# Altium project Time_skew.PrjPcb
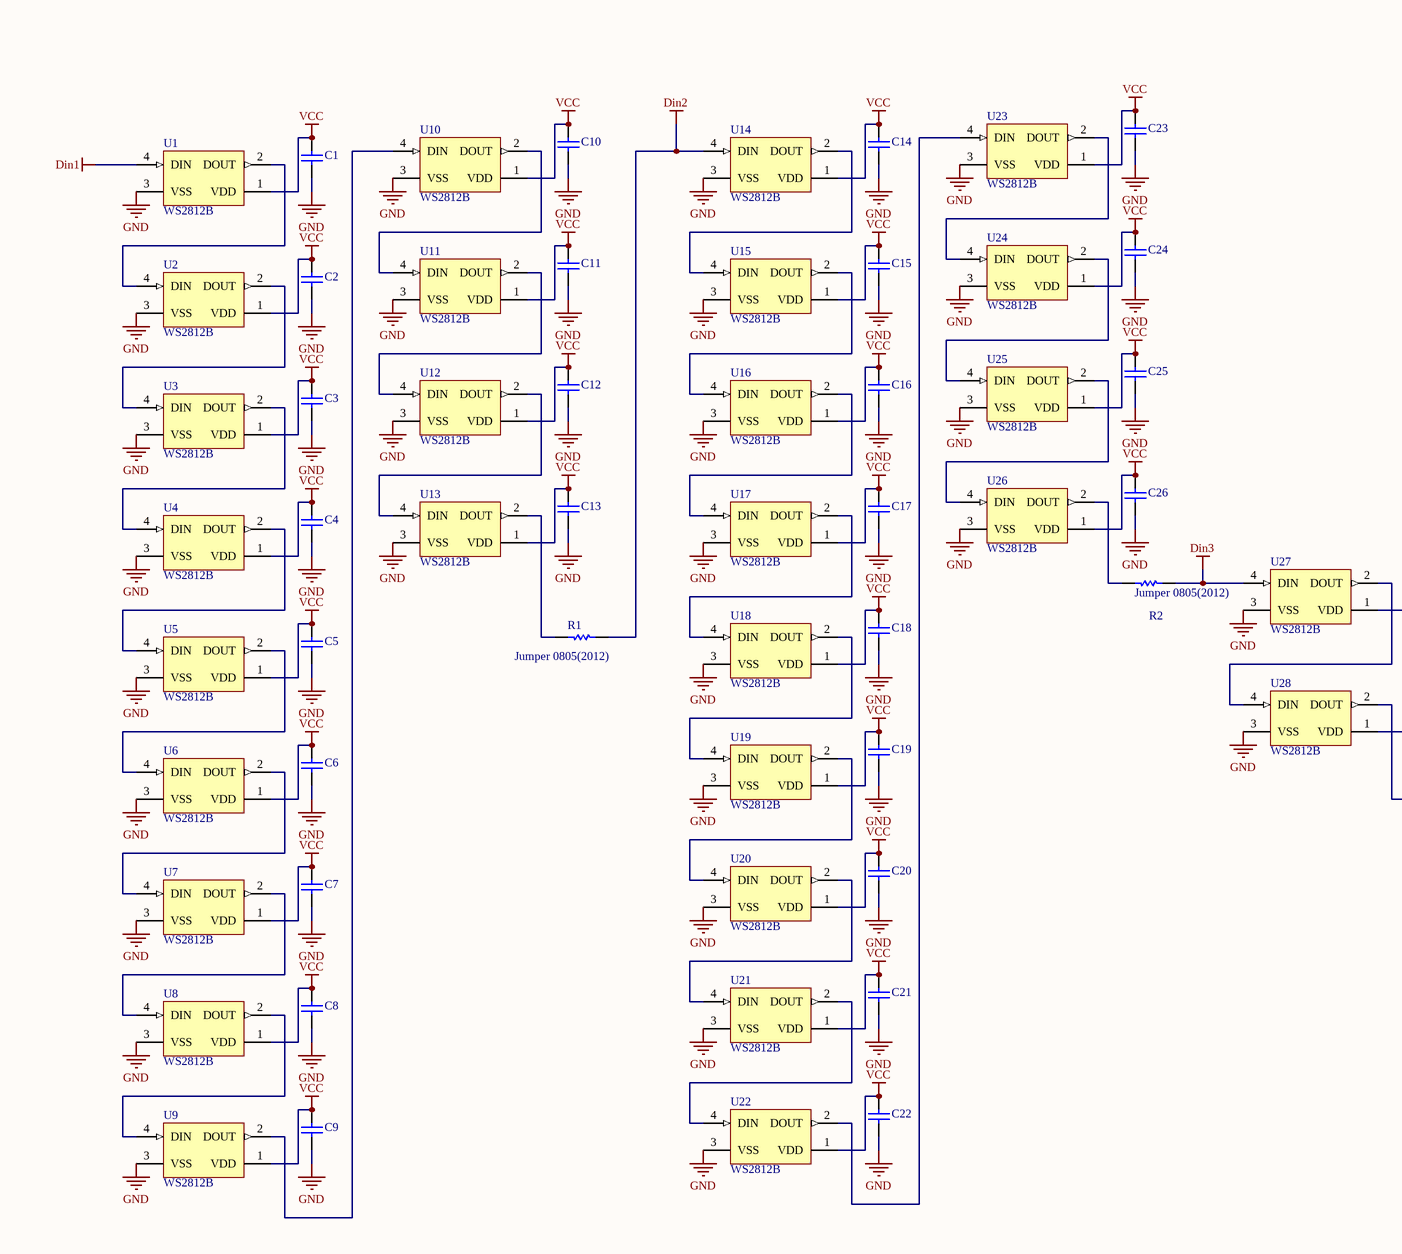
[diagram p0: Time._skew.SchDoc, left]
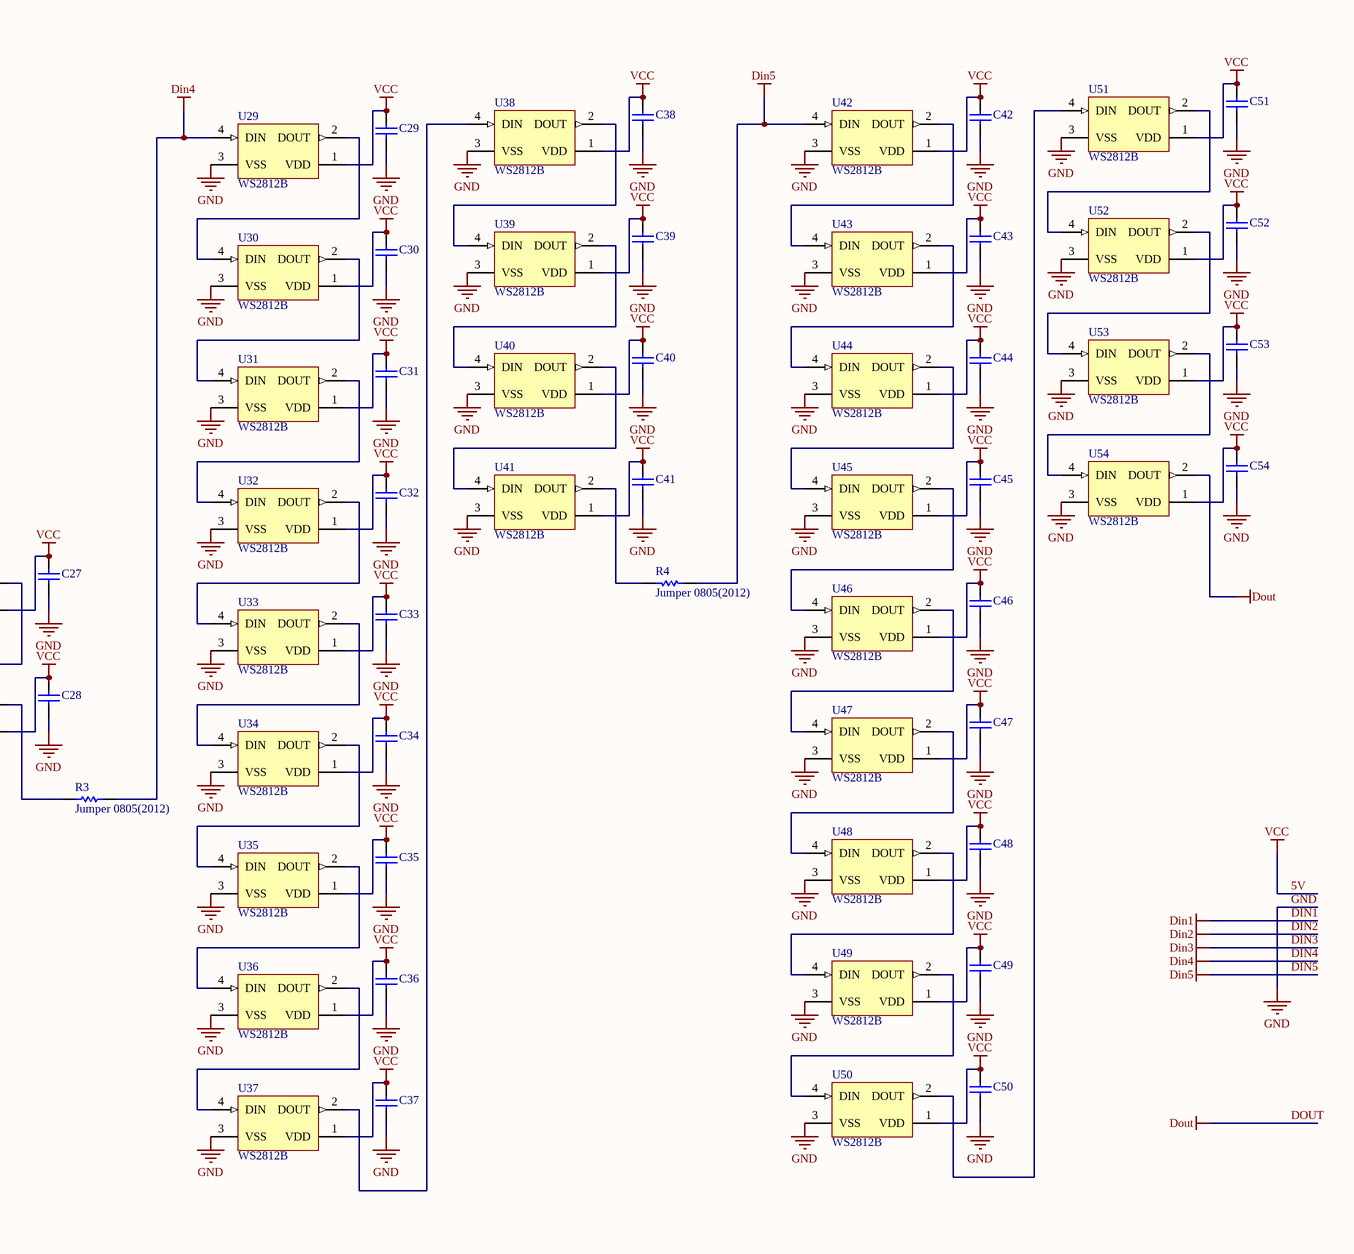
[diagram p1: Time._skew.SchDoc, right]
1 sheet, 112 parts. Net scope: global (net labels, ports and power ports of the same name join across sheets).
Board file: Time_skew.PcbDoc

## Sheet Time._skew.SchDoc: Time_skew
size A2; CheckedBy: Othniel Konan; Author: Othniel Konan; DrawnBy: Othniel Konan; Engineer: Othniel Konan; Address1: NPSC; Address2: Othniel Konan; Address3: ECE 2017; DocumentNumber: 1; Revision: 1.0; SheetNumber: 1; SheetTotal: 1; ProjectName: NPC

### Parts
C1  CAP 0.5pF 10V 0805(2012)  [CAPC0805(2012)100_L]  (value not drawn)
C2  CAP 0.5pF 10V 0805(2012)  [CAPC0805(2012)100_L]  (value not drawn)
C3  CAP 0.5pF 10V 0805(2012)  [CAPC0805(2012)100_L]  (value not drawn)
C4  CAP 0.5pF 10V 0805(2012)  [CAPC0805(2012)100_L]  (value not drawn)
C5  CAP 0.5pF 10V 0805(2012)  [CAPC0805(2012)100_L]  (value not drawn)
C6  CAP 0.5pF 10V 0805(2012)  [CAPC0805(2012)100_L]  (value not drawn)
C7  CAP 0.5pF 10V 0805(2012)  [CAPC0805(2012)100_L]  (value not drawn)
C8  CAP 0.5pF 10V 0805(2012)  [CAPC0805(2012)100_L]  (value not drawn)
C9  CAP 0.5pF 10V 0805(2012)  [CAPC0805(2012)100_L]  (value not drawn)
C10  CAP 0.5pF 10V 0805(2012)  [CAPC0805(2012)100_L]  (value not drawn)
C11  CAP 0.5pF 10V 0805(2012)  [CAPC0805(2012)100_L]  (value not drawn)
C12  CAP 0.5pF 10V 0805(2012)  [CAPC0805(2012)100_L]  (value not drawn)
C13  CAP 0.5pF 10V 0805(2012)  [CAPC0805(2012)100_L]  (value not drawn)
C14  CAP 0.5pF 10V 0805(2012)  [CAPC0805(2012)100_L]  (value not drawn)
C15  CAP 0.5pF 10V 0805(2012)  [CAPC0805(2012)100_L]  (value not drawn)
C16  CAP 0.5pF 10V 0805(2012)  [CAPC0805(2012)100_L]  (value not drawn)
C17  CAP 0.5pF 10V 0805(2012)  [CAPC0805(2012)100_L]  (value not drawn)
C18  CAP 0.5pF 10V 0805(2012)  [CAPC0805(2012)100_L]  (value not drawn)
C19  CAP 0.5pF 10V 0805(2012)  [CAPC0805(2012)100_L]  (value not drawn)
C20  CAP 0.5pF 10V 0805(2012)  [CAPC0805(2012)100_L]  (value not drawn)
C21  CAP 0.5pF 10V 0805(2012)  [CAPC0805(2012)100_L]  (value not drawn)
C22  CAP 0.5pF 10V 0805(2012)  [CAPC0805(2012)100_L]  (value not drawn)
C23  CAP 0.5pF 10V 0805(2012)  [CAPC0805(2012)100_L]  (value not drawn)
C24  CAP 0.5pF 10V 0805(2012)  [CAPC0805(2012)100_L]  (value not drawn)
C25  CAP 0.5pF 10V 0805(2012)  [CAPC0805(2012)100_L]  (value not drawn)
C26  CAP 0.5pF 10V 0805(2012)  [CAPC0805(2012)100_L]  (value not drawn)
C27  CAP 0.5pF 10V 0805(2012)  [CAPC0805(2012)100_L]  (value not drawn)
C28  CAP 0.5pF 10V 0805(2012)  [CAPC0805(2012)100_L]  (value not drawn)
C29  CAP 0.5pF 10V 0805(2012)  [CAPC0805(2012)100_L]  (value not drawn)
C30  CAP 0.5pF 10V 0805(2012)  [CAPC0805(2012)100_L]  (value not drawn)
C31  CAP 0.5pF 10V 0805(2012)  [CAPC0805(2012)100_L]  (value not drawn)
C32  CAP 0.5pF 10V 0805(2012)  [CAPC0805(2012)100_L]  (value not drawn)
C33  CAP 0.5pF 10V 0805(2012)  [CAPC0805(2012)100_L]  (value not drawn)
C34  CAP 0.5pF 10V 0805(2012)  [CAPC0805(2012)100_L]  (value not drawn)
C35  CAP 0.5pF 10V 0805(2012)  [CAPC0805(2012)100_L]  (value not drawn)
C36  CAP 0.5pF 10V 0805(2012)  [CAPC0805(2012)100_L]  (value not drawn)
C37  CAP 0.5pF 10V 0805(2012)  [CAPC0805(2012)100_L]  (value not drawn)
C38  CAP 0.5pF 10V 0805(2012)  [CAPC0805(2012)100_L]  (value not drawn)
C39  CAP 0.5pF 10V 0805(2012)  [CAPC0805(2012)100_L]  (value not drawn)
C40  CAP 0.5pF 10V 0805(2012)  [CAPC0805(2012)100_L]  (value not drawn)
C41  CAP 0.5pF 10V 0805(2012)  [CAPC0805(2012)100_L]  (value not drawn)
C42  CAP 0.5pF 10V 0805(2012)  [CAPC0805(2012)100_L]  (value not drawn)
C43  CAP 0.5pF 10V 0805(2012)  [CAPC0805(2012)100_L]  (value not drawn)
C44  CAP 0.5pF 10V 0805(2012)  [CAPC0805(2012)100_L]  (value not drawn)
C45  CAP 0.5pF 10V 0805(2012)  [CAPC0805(2012)100_L]  (value not drawn)
C46  CAP 0.5pF 10V 0805(2012)  [CAPC0805(2012)100_L]  (value not drawn)
C47  CAP 0.5pF 10V 0805(2012)  [CAPC0805(2012)100_L]  (value not drawn)
C48  CAP 0.5pF 10V 0805(2012)  [CAPC0805(2012)100_L]  (value not drawn)
C49  CAP 0.5pF 10V 0805(2012)  [CAPC0805(2012)100_L]  (value not drawn)
C50  CAP 0.5pF 10V 0805(2012)  [CAPC0805(2012)100_L]  (value not drawn)
C51  CAP 0.5pF 10V 0805(2012)  [CAPC0805(2012)100_L]  (value not drawn)
C52  CAP 0.5pF 10V 0805(2012)  [CAPC0805(2012)100_L]  (value not drawn)
C53  CAP 0.5pF 10V 0805(2012)  [CAPC0805(2012)100_L]  (value not drawn)
C54  CAP 0.5pF 10V 0805(2012)  [CAPC0805(2012)100_L]  (value not drawn)
R1  Jumper 0805(2012)  [RESC0805(2012)_N]
R2  Jumper 0805(2012)  [RESC0805(2012)_N]
R3  Jumper 0805(2012)  [RESC0805(2012)_N]
R4  Jumper 0805(2012)  [RESC0805(2012)_N]
U1  WS2812B  [ADAI-WS2812B_V]
U2  WS2812B  [ADAI-WS2812B_V]
U3  WS2812B  [ADAI-WS2812B_V]
U4  WS2812B  [ADAI-WS2812B_V]
U5  WS2812B  [ADAI-WS2812B_V]
U6  WS2812B  [ADAI-WS2812B_V]
U7  WS2812B  [ADAI-WS2812B_V]
U8  WS2812B  [ADAI-WS2812B_V]
U9  WS2812B  [ADAI-WS2812B_V]
U10  WS2812B  [ADAI-WS2812B_V]
U11  WS2812B  [ADAI-WS2812B_V]
U12  WS2812B  [ADAI-WS2812B_V]
U13  WS2812B  [ADAI-WS2812B_V]
U14  WS2812B  [ADAI-WS2812B_V]
U15  WS2812B  [ADAI-WS2812B_V]
U16  WS2812B  [ADAI-WS2812B_V]
U17  WS2812B  [ADAI-WS2812B_V]
U18  WS2812B  [ADAI-WS2812B_V]
U19  WS2812B  [ADAI-WS2812B_V]
U20  WS2812B  [ADAI-WS2812B_V]
U21  WS2812B  [ADAI-WS2812B_V]
U22  WS2812B  [ADAI-WS2812B_V]
U23  WS2812B  [ADAI-WS2812B_V]
U24  WS2812B  [ADAI-WS2812B_V]
U25  WS2812B  [ADAI-WS2812B_V]
U26  WS2812B  [ADAI-WS2812B_V]
U27  WS2812B  [ADAI-WS2812B_V]
U28  WS2812B  [ADAI-WS2812B_V]
U29  WS2812B  [ADAI-WS2812B_V]
U30  WS2812B  [ADAI-WS2812B_V]
U31  WS2812B  [ADAI-WS2812B_V]
U32  WS2812B  [ADAI-WS2812B_V]
U33  WS2812B  [ADAI-WS2812B_V]
U34  WS2812B  [ADAI-WS2812B_V]
U35  WS2812B  [ADAI-WS2812B_V]
U36  WS2812B  [ADAI-WS2812B_V]
U37  WS2812B  [ADAI-WS2812B_V]
U38  WS2812B  [ADAI-WS2812B_V]
U39  WS2812B  [ADAI-WS2812B_V]
U40  WS2812B  [ADAI-WS2812B_V]
U41  WS2812B  [ADAI-WS2812B_V]
U42  WS2812B  [ADAI-WS2812B_V]
U43  WS2812B  [ADAI-WS2812B_V]
U44  WS2812B  [ADAI-WS2812B_V]
U45  WS2812B  [ADAI-WS2812B_V]
U46  WS2812B  [ADAI-WS2812B_V]
U47  WS2812B  [ADAI-WS2812B_V]
U48  WS2812B  [ADAI-WS2812B_V]
U49  WS2812B  [ADAI-WS2812B_V]
U50  WS2812B  [ADAI-WS2812B_V]
U51  WS2812B  [ADAI-WS2812B_V]
U52  WS2812B  [ADAI-WS2812B_V]
U53  WS2812B  [ADAI-WS2812B_V]
U54  WS2812B  [ADAI-WS2812B_V]

### Nets
5V: C1.2 C2.2 C3.2 C4.2 C5.2 C6.2 C7.2 C8.2 C9.2 C10.2 C11.2 C12.2 C13.2 C14.2 C15.2 C16.2 C17.2 C18.2 C19.2 C20.2 C21.2 C22.2 C23.2 C24.2 C25.2 C26.2 C27.2 C28.2 C29.2 C30.2 C31.2 C32.2 C33.2 C34.2 C35.2 C36.2 C37.2 C38.2 C39.2 C40.2 C41.2 C42.2 C43.2 C44.2 C45.2 C46.2 C47.2 C48.2 C49.2 C50.2 C51.2 C52.2 C53.2 C54.2 U1.1(VDD) U2.1(VDD) U3.1(VDD) U4.1(VDD) U5.1(VDD) U6.1(VDD) U7.1(VDD) U8.1(VDD) U9.1(VDD) U10.1(VDD) U11.1(VDD) U12.1(VDD) U13.1(VDD) U14.1(VDD) U15.1(VDD) U16.1(VDD) U17.1(VDD) U18.1(VDD) U19.1(VDD) U20.1(VDD) U21.1(VDD) U22.1(VDD) U23.1(VDD) U24.1(VDD) U25.1(VDD) U26.1(VDD) U27.1(VDD) U28.1(VDD) U29.1(VDD) U30.1(VDD) U31.1(VDD) U32.1(VDD) U33.1(VDD) U34.1(VDD) U35.1(VDD) U36.1(VDD) U37.1(VDD) U38.1(VDD) U39.1(VDD) U40.1(VDD) U41.1(VDD) U42.1(VDD) U43.1(VDD) U44.1(VDD) U45.1(VDD) U46.1(VDD) U47.1(VDD) U48.1(VDD) U49.1(VDD) U50.1(VDD) U51.1(VDD) U52.1(VDD) U53.1(VDD) U54.1(VDD)  [also labelled VCC]
DIN1: U1.4(DIN)
DIN2: R1.2 U14.4(DIN)
DIN3: R2.2 U27.4(DIN)
DIN4: R3.1 U29.4(DIN)
DIN5: R4.1 U42.4(DIN)
DOUT: U54.2(DOUT)
GND: C1.1 C2.1 C3.1 C4.1 C5.1 C6.1 C7.1 C8.1 C9.1 C10.1 C11.1 C12.1 C13.1 C14.1 C15.1 C16.1 C17.1 C18.1 C19.1 C20.1 C21.1 C22.1 C23.1 C24.1 C25.1 C26.1 C27.1 C28.1 C29.1 C30.1 C31.1 C32.1 C33.1 C34.1 C35.1 C36.1 C37.1 C38.1 C39.1 C40.1 C41.1 C42.1 C43.1 C44.1 C45.1 C46.1 C47.1 C48.1 C49.1 C50.1 C51.1 C52.1 C53.1 C54.1 U1.3(VSS) U2.3(VSS) U3.3(VSS) U4.3(VSS) U5.3(VSS) U6.3(VSS) U7.3(VSS) U8.3(VSS) U9.3(VSS) U10.3(VSS) U11.3(VSS) U12.3(VSS) U13.3(VSS) U14.3(VSS) U15.3(VSS) U16.3(VSS) U17.3(VSS) U18.3(VSS) U19.3(VSS) U20.3(VSS) U21.3(VSS) U22.3(VSS) U23.3(VSS) U24.3(VSS) U25.3(VSS) U26.3(VSS) U27.3(VSS) U28.3(VSS) U29.3(VSS) U30.3(VSS) U31.3(VSS) U32.3(VSS) U33.3(VSS) U34.3(VSS) U35.3(VSS) U36.3(VSS) U37.3(VSS) U38.3(VSS) U39.3(VSS) U40.3(VSS) U41.3(VSS) U42.3(VSS) U43.3(VSS) U44.3(VSS) U45.3(VSS) U46.3(VSS) U47.3(VSS) U48.3(VSS) U49.3(VSS) U50.3(VSS) U51.3(VSS) U52.3(VSS) U53.3(VSS) U54.3(VSS)
NetR1_1: R1.1 U13.2(DOUT)
NetR2_1: R2.1 U26.2(DOUT)
NetR3_2: R3.2 U28.2(DOUT)
NetR4_2: R4.2 U41.2(DOUT)
NetU1_2: U1.2(DOUT) U2.4(DIN)
NetU2_2: U2.2(DOUT) U3.4(DIN)
NetU3_2: U3.2(DOUT) U4.4(DIN)
NetU4_2: U4.2(DOUT) U5.4(DIN)
NetU5_2: U5.2(DOUT) U6.4(DIN)
NetU6_2: U6.2(DOUT) U7.4(DIN)
NetU7_2: U7.2(DOUT) U8.4(DIN)
NetU8_2: U8.2(DOUT) U9.4(DIN)
NetU9_2: U9.2(DOUT) U10.4(DIN)
NetU10_2: U10.2(DOUT) U11.4(DIN)
NetU11_2: U11.2(DOUT) U12.4(DIN)
NetU12_2: U12.2(DOUT) U13.4(DIN)
NetU14_2: U14.2(DOUT) U15.4(DIN)
NetU15_2: U15.2(DOUT) U16.4(DIN)
NetU16_2: U16.2(DOUT) U17.4(DIN)
NetU17_2: U17.2(DOUT) U18.4(DIN)
NetU18_2: U18.2(DOUT) U19.4(DIN)
NetU19_2: U19.2(DOUT) U20.4(DIN)
NetU20_2: U20.2(DOUT) U21.4(DIN)
NetU21_2: U21.2(DOUT) U22.4(DIN)
NetU22_2: U22.2(DOUT) U23.4(DIN)
NetU23_2: U23.2(DOUT) U24.4(DIN)
NetU24_2: U24.2(DOUT) U25.4(DIN)
NetU25_2: U25.2(DOUT) U26.4(DIN)
NetU27_2: U27.2(DOUT) U28.4(DIN)
NetU29_2: U29.2(DOUT) U30.4(DIN)
NetU30_2: U30.2(DOUT) U31.4(DIN)
NetU31_2: U31.2(DOUT) U32.4(DIN)
NetU32_2: U32.2(DOUT) U33.4(DIN)
NetU33_2: U33.2(DOUT) U34.4(DIN)
NetU34_2: U34.2(DOUT) U35.4(DIN)
NetU35_2: U35.2(DOUT) U36.4(DIN)
NetU36_2: U36.2(DOUT) U37.4(DIN)
NetU37_2: U37.2(DOUT) U38.4(DIN)
NetU38_2: U38.2(DOUT) U39.4(DIN)
NetU39_2: U39.2(DOUT) U40.4(DIN)
NetU40_2: U40.2(DOUT) U41.4(DIN)
NetU42_2: U42.2(DOUT) U43.4(DIN)
NetU43_2: U43.2(DOUT) U44.4(DIN)
NetU44_2: U44.2(DOUT) U45.4(DIN)
NetU45_2: U45.2(DOUT) U46.4(DIN)
NetU46_2: U46.2(DOUT) U47.4(DIN)
NetU47_2: U47.2(DOUT) U48.4(DIN)
NetU48_2: U48.2(DOUT) U49.4(DIN)
NetU49_2: U49.2(DOUT) U50.4(DIN)
NetU50_2: U50.2(DOUT) U51.4(DIN)
NetU51_2: U51.2(DOUT) U52.4(DIN)
NetU52_2: U52.2(DOUT) U53.4(DIN)
NetU53_2: U53.2(DOUT) U54.4(DIN)

### Notes on the sheet
- Title
- Size:
- Date:
- File:
- A2
- Number:
- Time:
- Revision:
- Sheet
- of

### Library data of the parts
C1-C54 = CMP-1036-00005-1: CAP 0.5pF 10V ±0.5pF 0805 (2012 Metric) Thickness 1mm SMD; Case-Metric: 2012; Case-EIA: 0805; Tolerance: Â±0.5pF; Rated Voltage: 10 V; Max Thickness: 1 mm; Technology: SMT; Value: 0.5pF
R1-R4 = CMP-1013-00001-1: Jumper 0805 (2012 Metric); Case-EIA: 0805; Power: None; Case-Metric: 2012; Value: 0.00 Ohm; Technology: SMT; Tolerance: None
U1-U54 = CMP-1740-00005-1: Intelligent Control LED Integrated Light Source, 3.5 to 5.3 V, -25 to 80 degC, 4-Pin SMD, RoHS, Bulk; Case\Package: Radial; Shielding: Unshielded; Current Rating: 240 mA; Tolerance: 10%; Mount: Through Hole; Max Operating Temperature: 125 degC; Radiation Hardening: No; Length: 12.2 mm; Min Operating Temperature: -55 degC; ComponentLink1URL: https://www.adafruit.com/; Packaging: Bulk; Lead Pitch: 5 mm; RoHSCompliant: true; Pins: 2; Package Quantity: 200; ComponentLink2URL: https://cdn-shop.adafruit.com/datasheets/WS2812B.pdf; ComponentLink2Description: Datasheet; PackageDescription: 4-Pin Surface Mount Device, Body 5 x 5 mm, Pitch 3.3 mm; PackageReference: WS2812B; Height: 12.2 mm; REACH SVHC: No SVHC; ComponentLink1Description: Manufacturer URL; DatasheetVersion: May-13